# Altium schematic sheet 06_Relays.SchDoc
size A4; SheetNumber: 6; SheetTotal: 6
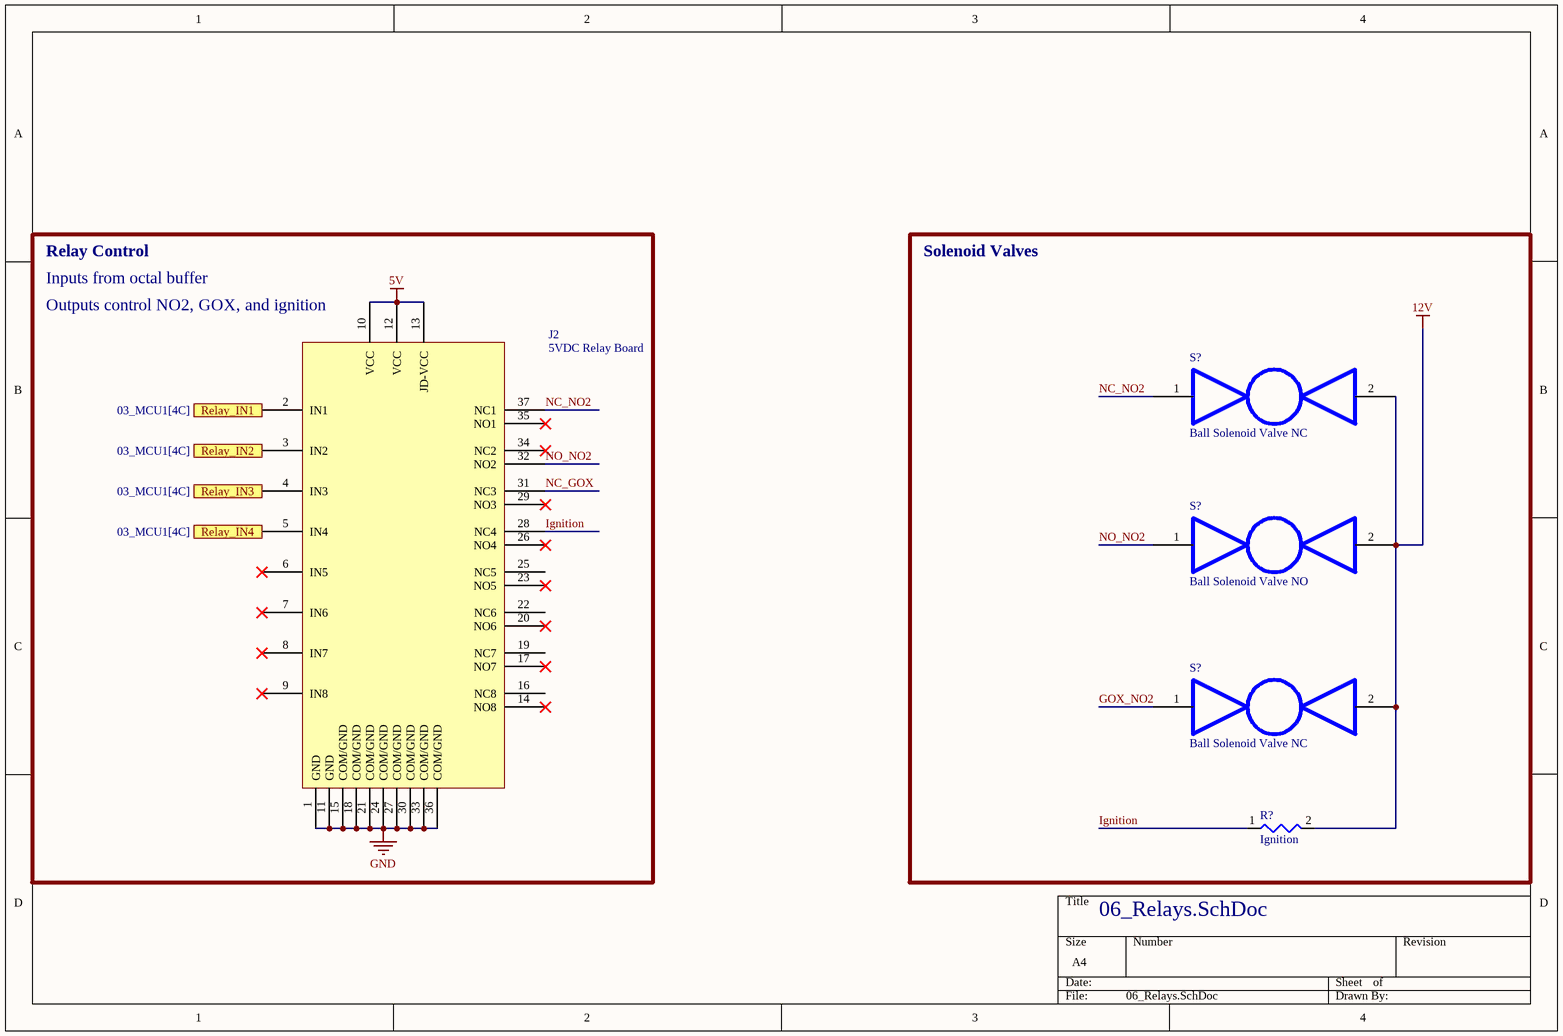
[diagram p0: 06_Relays.SchDoc]

## Parts
(Parts that share a designator on the sheet are numbered #1, #2 ... from top to bottom, then left to right.)
J2  5VDC Relay Board  [ELEGOO Relay Board]
R?  Ignition
S?#1  Ball Solenoid Valve NC
S?#2  Ball Solenoid Valve NO
S?#3  Ball Solenoid Valve NC

## Blocks framed on the sheet
Solenoid Valves: R? S?#1-S?#3

## Ports
Relay_IN1 (in, see 03_MCU1[4C]), Relay_IN2 (in, see 03_MCU1[4C]), Relay_IN3 (in, see 03_MCU1[4C]), Relay_IN4 (in, see 03_MCU1[4C])

## Nets
5V: J2.10(VCC) J2.12(VCC) J2.13(JD-VCC)
12V: R?.2 S?#1.2 S?#2.2 S?#3.2
GND: J2.1(GND) J2.11(GND) J2.15(COM/GND) J2.18(COM/GND) J2.21(COM/GND) J2.24(COM/GND) J2.27(COM/GND) J2.30(COM/GND) J2.33(COM/GND) J2.36(COM/GND)
GOX_NO2: S?#3.1
Ignition: J2.28(NC4) R?.1
NC_GOX: J2.31(NC3)
NC_NO2: J2.37(NC1) S?#1.1
NO_NO2: J2.32(NO2) S?#2.1
Relay_IN1: J2.2(IN1) ; port Relay_IN1
Relay_IN2: J2.3(IN2) ; port Relay_IN2
Relay_IN3: J2.4(IN3) ; port Relay_IN3
Relay_IN4: J2.5(IN4) ; port Relay_IN4

Not connected (* = marked no-connect by the designer): J2 6(IN5)* 7(IN6)* 8(IN7)* 9(IN8)* 14(NO8)* 16(NC8) 17(NO7)* 19(NC7) 20(NO6)* 22(NC6) 23(NO5)* 25(NC5) 26(NO4)* 29(NO3)* 34(NC2)* 35(NO1)*

## Notes on the sheet
- Relay Control
- Inputs from octal buffer
- (near J2) Outputs control NO2, GOX, and ignition

## Library data of the parts
J2 = ELEGOO Relay Board
R? = Ignition: Ignite rocket. Unknown resistance.